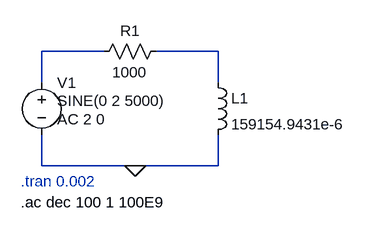
[diagram p0: schematic RL filter.asc]
RL filter.asc, the LTspice schematic file:
Version 4.1
SHEET 1 880 680
WIRE 128 64 32 64
WIRE 304 64 208 64
WIRE 32 112 32 64
WIRE 304 112 304 64
WIRE 32 240 32 192
WIRE 176 240 32 240
WIRE 304 240 304 192
WIRE 304 240 176 240
FLAG 176 240 0
SYMBOL ind 288 96 R0
SYMATTR InstName L1
SYMATTR Value 159154.9431e-6
SYMATTR SpiceLine Rser=1m
SYMBOL res 224 48 R90
WINDOW 0 0 56 VBottom 2
WINDOW 3 32 56 VTop 2
SYMATTR InstName R1
SYMATTR Value 1000
SYMBOL voltage 32 96 R0
WINDOW 3 24 44 Left 2
WINDOW 123 24 72 Left 2
WINDOW 39 0 0 Left 0
SYMATTR InstName V1
SYMATTR Value SINE(0 2 5000)
SYMATTR Value2 AC 2 0
TEXT 0 264 Left 2 ;.tran 0.002
TEXT 0 296 Left 2 !.ac dec 100 1 100E9

The netlist it stands for:
* RL filter.asc
L1 N002 0 159154.9431e-6 Rser=1m
R1 N002 N001 1000
V1 N001 0 SINE(0 2 5000) AC 2 0
* .tran 0.002
.ac dec 100 1 100E9
.backanno
.end